# Altium schematic sheet BC95-G.SchDoc
size A3; SheetNumber: 5; SheetTotal: 5
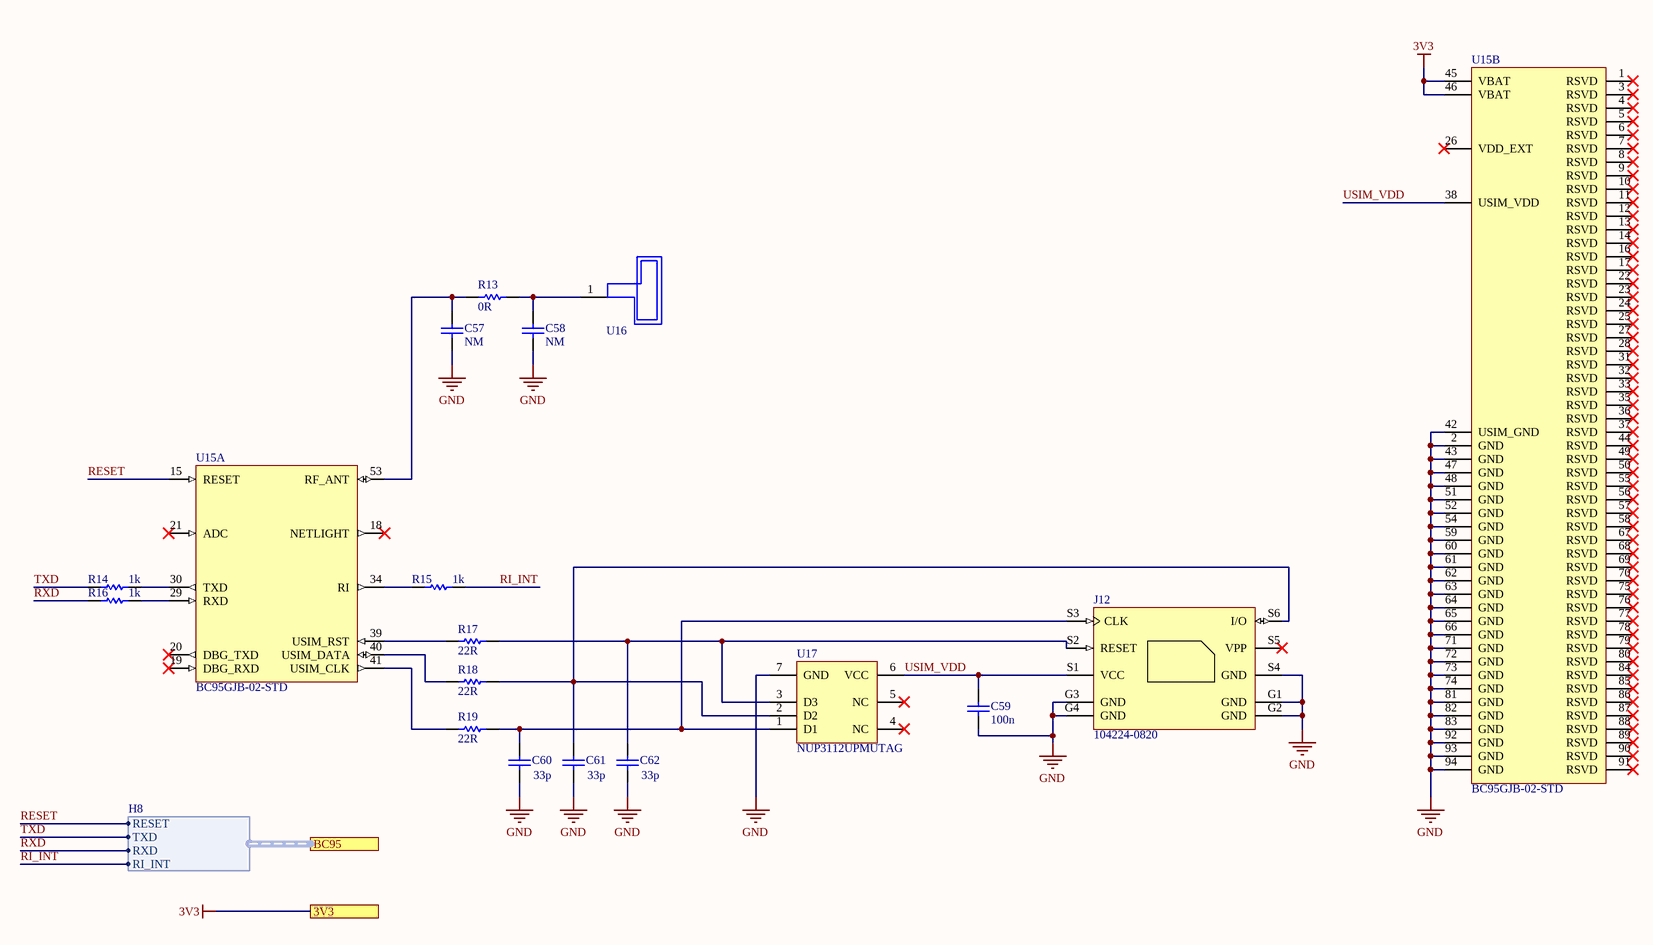
[diagram p0: BC95-G.SchDoc]

## Parts
C57  NM  [CAPC1608X90X35ML10T15]
C58  NM  [CAPC1608X90X35ML10T15]
C59  100n  [CAPC1005X60X30ML05T10]
C60  33p  [CAPC1005X56X25ML10T15]
C61  33p  [CAPC1005X56X25ML10T15]
C62  33p  [CAPC1005X56X25ML10T15]
J12  104224-0820  [1042240820]
R13  0R  [RESC1609X55X30ML10T20]
R14  1k  [RESC1005X40X25NL05T05]
R15  1k  [RESC1005X40X25NL05T05]
R16  1k  [RESC1005X40X25NL05T05]
R17  22R  [RESC1005X40X25LL05T05]
R18  22R  [RESC1005X40X25LL05T05]
R19  22R  [RESC1005X40X25LL05T05]
U15  BC95GJB-02-STD  [BC95GJB-02-STD]  (parts A,B of 2)
U16  FR01-S4-224  [FR01-S4-224]  (value not drawn)
U17  NUP3112UPMUTAG  [ONSC-UDFN-6-517AP-01_V]

## Ports
3V3, BC95 (harness H8)

## Harnesses
H8: RESET, TXD, RXD, RI_INT

## Nets
3V3: U15.45(VBAT) U15.46(VBAT) ; port 3V3
GND: C57.1 C58.1 C59.1 C60.1 C61.1 C62.1 J12.G1(GND) J12.G2(GND) J12.G3(GND) J12.G4(GND) J12.S4(GND) U15.2(GND) U15.42(USIM_GND) U15.43(GND) U15.47(GND) U15.48(GND) U15.51(GND) U15.52(GND) U15.54(GND) U15.59(GND) U15.60(GND) U15.61(GND) U15.62(GND) U15.63(GND) U15.64(GND) U15.65(GND) U15.66(GND) U15.71(GND) U15.72(GND) U15.73(GND) U15.74(GND) U15.81(GND) U15.82(GND) U15.83(GND) U15.92(GND) U15.93(GND) U15.94(GND) U17.7(GND)
RESET: U15.15(RESET) ; port BC95.RESET
RI_INT: R15.2 ; port BC95.RI_INT
RXD: R16.1 ; port BC95.RXD
TXD: R14.1 ; port BC95.TXD
USIM_VDD: C59.2 J12.S1(VCC) U15.38(USIM_VDD) U17.6(VCC)
NetC57_2: C57.2 R13.1 U15.53(RF_ANT)
NetC58_2: C58.2 R13.2 U16.1
NetC60_2: C60.2 J12.S3(CLK) R19.2 U17.1(D1)
NetC61_2: C61.2 J12.S6(I/O) R18.2 U17.2(D2)
NetC62_2: C62.2 J12.S2(RESET) R17.2 U17.3(D3)
NetR14_2: R14.2 U15.30(TXD)
NetR15_1: R15.1 U15.34(RI)
NetR16_2: R16.2 U15.29(RXD)
NetR17_1: R17.1 U15.39(USIM_RST)
NetR18_1: R18.1 U15.40(USIM_DATA)
NetR19_1: R19.1 U15.41(USIM_CLK)

Not connected (* = marked no-connect by the designer): J12 S5(VPP)*; U15 1(RSVD)* 3(RSVD)* 4(RSVD)* 5(RSVD)* 6(RSVD)* 7(RSVD)* 8(RSVD)* 9(RSVD)* 10(RSVD)* 11(RSVD)* 12(RSVD)* 13(RSVD)* 14(RSVD)* 16(RSVD)* 17(RSVD)* 18(NETLIGHT)* 19(DBG_RXD)* 20(DBG_TXD)* 21(ADC)* 22(RSVD)* 23(RSVD)* 24(RSVD)* 25(RSVD)* 26(VDD_EXT)* 27(RSVD)* 28(RSVD)* 31(RSVD)* 32(RSVD)* 33(RSVD)* 35(RSVD)* 36(RSVD)* 37(RSVD)* 44(RSVD)* 49(RSVD)* 50(RSVD)* 55(RSVD)* 56(RSVD)* 57(RSVD)* 58(RSVD)* 67(RSVD)* 68(RSVD)* 69(RSVD)* 70(RSVD)* 75(RSVD)* 76(RSVD)* 77(RSVD)* 78(RSVD)* 79(RSVD)* 80(RSVD)* 84(RSVD)* 85(RSVD)* 86(RSVD)* 87(RSVD)* 88(RSVD)* 89(RSVD)* 90(RSVD)* 91(RSVD)*; U17 4(NC)* 5(NC)*

## Notes on the sheet
- 1
- 2
- 3
- 4
- 5
- 6
- 7
- 8
- A
- B
- C
- D
- Project:
- Date:
- Drawing number:
- Rev:
- Format:
- A3
- Drawn by:
- Laboratory:
- Page
- Sheet:
- of
- File:

## Library data of the parts
C57 C58 = CMP-2100-03643-1: Chip Capacitor, 0.1 uF, +/- 10%, 50 V, -55 to 125 degC, 0603 (1608 Metric), RoHS, Tape and Reel; Manufacturer: Murata; Dielectric Material: Ceramic; Voltage Rating: 50V; Capacitance: 100nF; Dielectric: X7R; Insulation Resistance: 10GR; Case Code (Metric): 1608; Lead Free: LeadFree; Depth: 0.8mm; Number of Pins: 2; Radiation Hardening: No; Case/Package: 0603; Manufacturer URL: http://www.murata.com/; Packaging: TapeandReel; Length: 1.6mm; Contact Plating: Tin; Datasheet URL: http://psearch.en.murata.com/capacitor/product/GRM188R71H104KA93%23.pdf; Tolerance: 10%; Case Code (Imperial): 0603; Min Operating Temperature: -55degC; RoHSCompliant: true; Voltage: 50V; Termination: SMD/SMT; Mount: SurfaceMount; Material: Ceramic; Package Quantity: 1; Height: 0.8mm; Thickness: 0.035inch; REACH SVHC: NoSVHC; Max Operating Temperature: 125degC; Width: 0.8mm; Package Reference: 0603; Voltage Rating (DC): 50V; Datasheet Version: 42675.0; Package Description: 2-Pin Surface Mount Device, Body 1.6 x 0.8 mm
C59 = CMP-2008-02046-1: Manufacturer: Kemet; Part Number: C0402C104K8PACTU
C60-C62 = CMP-2008-02494-1: Manufacturer: AVX Interconnect / Elco; Part Number: 04023A330JAT2A
J12 = CMP-00970-1: 6 Position Card Connector NANO SIM Surface Mount, Right Angle Gold; Pitch: 2.54mm; Mount: Surface Mount; Number of Rows: 2; Orientation: Right Angle
R13 = CMP-2000-03816-1: Part Number: CRCW06030000Z0EA; Manufacturer: Vishay Dale
R14-R16 = CMP-2002-08276-1: Manufacturer: Vishay Dale; Part Number: CRCW04021K00FKED
R17-R19 = CMP-2002-01135-1: Part Number: ERJ2RKF22R0X; Manufacturer: Panasonic
U15 = CMP-01264-1: NB-IoT Module 54Kbps UART 700MHz to 2100MHz 3.6V Surface Mount; Manufacturer: Quectel Wireless Solutions; Screening Level: Industrial; Sensitivity: -129 dBm; Frequency Range: 700, 2100 MHz; Product Dimensions: 23.6 x 19.9 x 2.2 mm; Type: NB-IoT Module; Mounting: Surface Mount; Interface Type: UART; Manufacturer Part Number: BC95GJB-02-STD; Operating Temperature: -40 to 85 °C; Data Rate: 54 Kbps; Operating Supply Voltage: 3.6 V
U16 = CMP-01638-1: 700MHz, 800MHz, 850MHz, 900MHz, 1.7GHz, 1.8GHz, 1.9GHz, 2GHz, 2.1GHz, 2.3GHz, 2.5GHz, 2.6GHz, 3.5GHz, 3.7GHz DCS, GSM, LTE, PCS, UMTS Chip RF Antenna 698MHz ~ 960MHz, 1.71GHz ~ 2.69GHz, 3.4GHz ~ 3.8GHz 1.6dBi, 3.7dBi, 3.1dBi Solder Surface Mount; Manufacturer: Fractus Antennas S.L.; VSWR: 3; RF Family/Standard: Cellular; Frequency Group: Wide Band; Number of Bands: 14; Manufacturer Part Number: FR01-S4-224; Frequency (Center/Band): 700MHz, 800MHz, 850MHz, 900MHz, 1.7GHz, 1.8GHz, 1.9GHz, 2GHz, 2.1GHz, 2.3GHz, 2.5GHz, 2.6GHz, 3.5GHz, 3.7GHz; Packaging: Cut Tape (CT); Frequency Range: 698MHz ~ 960MHz, 1.71GHz ~ 2.69GHz, 3.4GHz ~ 3.8GHz; Gain: 1.6dBi, 3.7dBi, 3.1dBi; Part Status: Active; Antenna Type: Chip; Series: RUN mXTEND™; Termination: Solder; Features: -; Ingress Protection: -; Applications: DCS, GSM, LTE, PCS, UMTS; Return Loss: -; Mounting Type: Surface Mount; Height (Max): 0.094" (2.40mm)
U17 = CMP-1063-00253-1: Quad Transient Voltage Suppressor Array, ESD Protection Diodes with Ultra-Low (0.7 pF) Capacitance, 6-Pin UDFN, Pb-Free, Tape and Reel; Manufacturer: On Semiconductor; Direction: Unidirectional; Number of Lines: 4; C Max (pF): 0.9; IR Max (uA): 1; PartNumber: NUP3112UPMUTAG; Mounting Technology: Surface Mount; ComponentLink1Description: Manufacturer URL; PackageVersion: Rev. O, 10/2007; ComponentLink3URL: http://www.onsemi.com/pub_link/Collateral/517AP.PDF; DatasheetVersion: Rev. 0; PackageReference: UDFN-6-517AP-01; ComponentLink2URL: http://www.onsemi.cn/pub_link/Collateral/NUP3112UPMU-D.PDF; PackageDescription: 6-Pin Small Outline No-Lead, Body 1.6 x 1.6 mm, Pitch 0.5 mm; Packing: Tape and Reel; ComponentLink1URL: http://www.onsemi.com/; ComponentLink2Description: Datasheet; RoHS: Pb-Free; ComponentLink3Description: Package Specification